# Altium schematic sheet ES.SchDoc
size Letter; DocumentNumber: 7; SheetNumber: 7; SheetTotal: 8
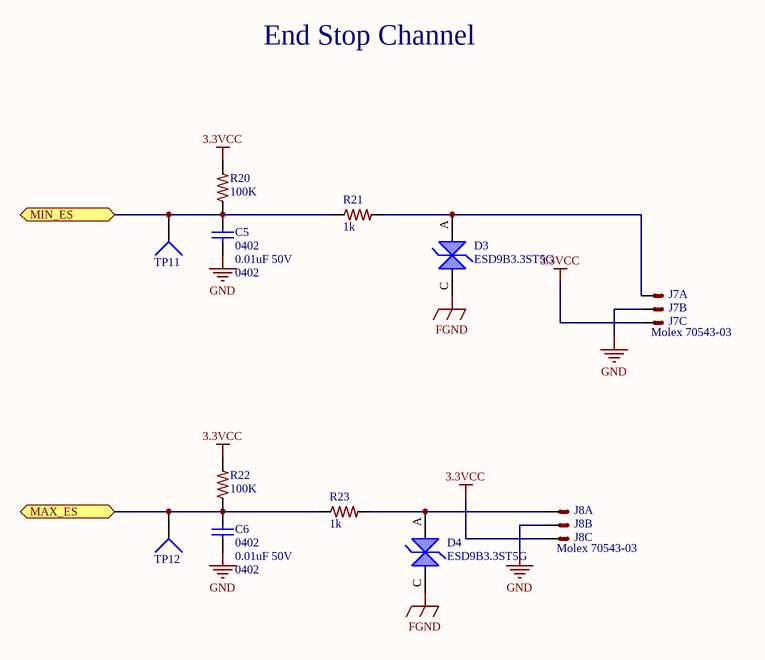
[diagram p0: ES.SchDoc]

## Parts
C5  0402  value 0.01uF 50V  [C0402]
C6  0402  value 0.01uF 50V  [C0402]
D3  ESD9B3.3ST5G  [SOD923-100X40-2N]
D4  ESD9B3.3ST5G  [SOD923-100X40-2N]
J7  Molex 70543-03  [70543-03]  (value not drawn)  (parts A,B,C of 3)
J8  Molex 70543-03  [70543-03]  (value not drawn)  (parts A,B,C of 3)
R20  100K  [R0402]
R21  1k  [R0402]
R22  100K  [R0402]
R23  1k  [R0402]
TP11  TP4  [TP-2]  (value not drawn)
TP12  TP4  [TP-2]  (value not drawn)

## Ports
MAX_ES, MIN_ES

## Nets
3.3VCC: J7.3(S) J8.3(S) R20.2 R22.2
FGND: D3.C D4.C
GND: C5.2 C6.2 J7.2(S) J8.2(S)
MAX_ES: C6.1 R22.1 R23.1 TP12.1 ; port MAX_ES
MIN_ES: C5.1 R20.1 R21.1 TP11.1 ; port MIN_ES
NetD3_A: D3.A J7.1(S) R21.2
NetD4_A: D4.A J8.1(S) R23.2

## Notes on the sheet
- End Stop Channel

## Library data of the parts
C5 C6 = GRM155R71H103JA88D: CAP CER 10nF 50V X7R 0402; MFR: Murata; Part Description: CAP CER 10000PF 50V X7R 0402; Tolerance: 10%; Voltage: 6.3VDC; Published: 10 - Dec - 2014; Publisher: Ultimachine; LatestRevisionDate: 10 - Dec - 2014; LatestRevisionNote: Ultimachine Footprint Added; Component Type: Chip Capacitor; MFR Part #: GRM155R71H103JA88D; Mounting Type: SMT 0402; Datasheet: http://search.murata.co.jp/Ceramy/image/img/A01X/G101/ENG/GRM155R71H103JA88-01.pdf; Height: 0.5 ±0.05mm; Digikey #: 490-7763-1-ND; PackageReference: 0402
D3 D4 = ESD9B3.3ST5G: 11.5 V 15 pF SMT Transient Voltage Suppressor - SOD-923
J7 J8 = C-GRID-03-70543: Connector 2pos 2.54mm locking; LastRevisionNote: ImportComponents; Published: 23-Apr-2014; Publisher: UltiMachine; LastRevisionDate: 23-Apr-2014
R20 R22 = RC1005F104CS: RES SMD 100K OHM 1% 1/16W 0402; Manufacturer: Samsung; LastRevisionNote: ImportComponents; Digilkey #: 1276-3432-1-ND; Published: 23-Apr-2014; Publisher: UltiMachine; LastRevisionDate: 23-Apr-2014; ManufacturerPartNumber: RC1005F104CS; VALUE: 100K
R21 R23 = RK73H1ETTP1001F: RES 0402 1k 63mW 1%; LastRevisionNote: ImportComponents; Published: 23-Apr-2014; Publisher: UltiMachine; LastRevisionDate: 23-Apr-2014; VALUE: 1k
TP11 TP12 = Socket: LatestRevisionDate: 17-Jul-2002; LatestRevisionNote: Re-released for DXP Platform.; Publisher: Altium Limited